# Altium schematic sheet Power_Distribution.SchDoc
size A4; SheetNumber: 3; SheetTotal: 5
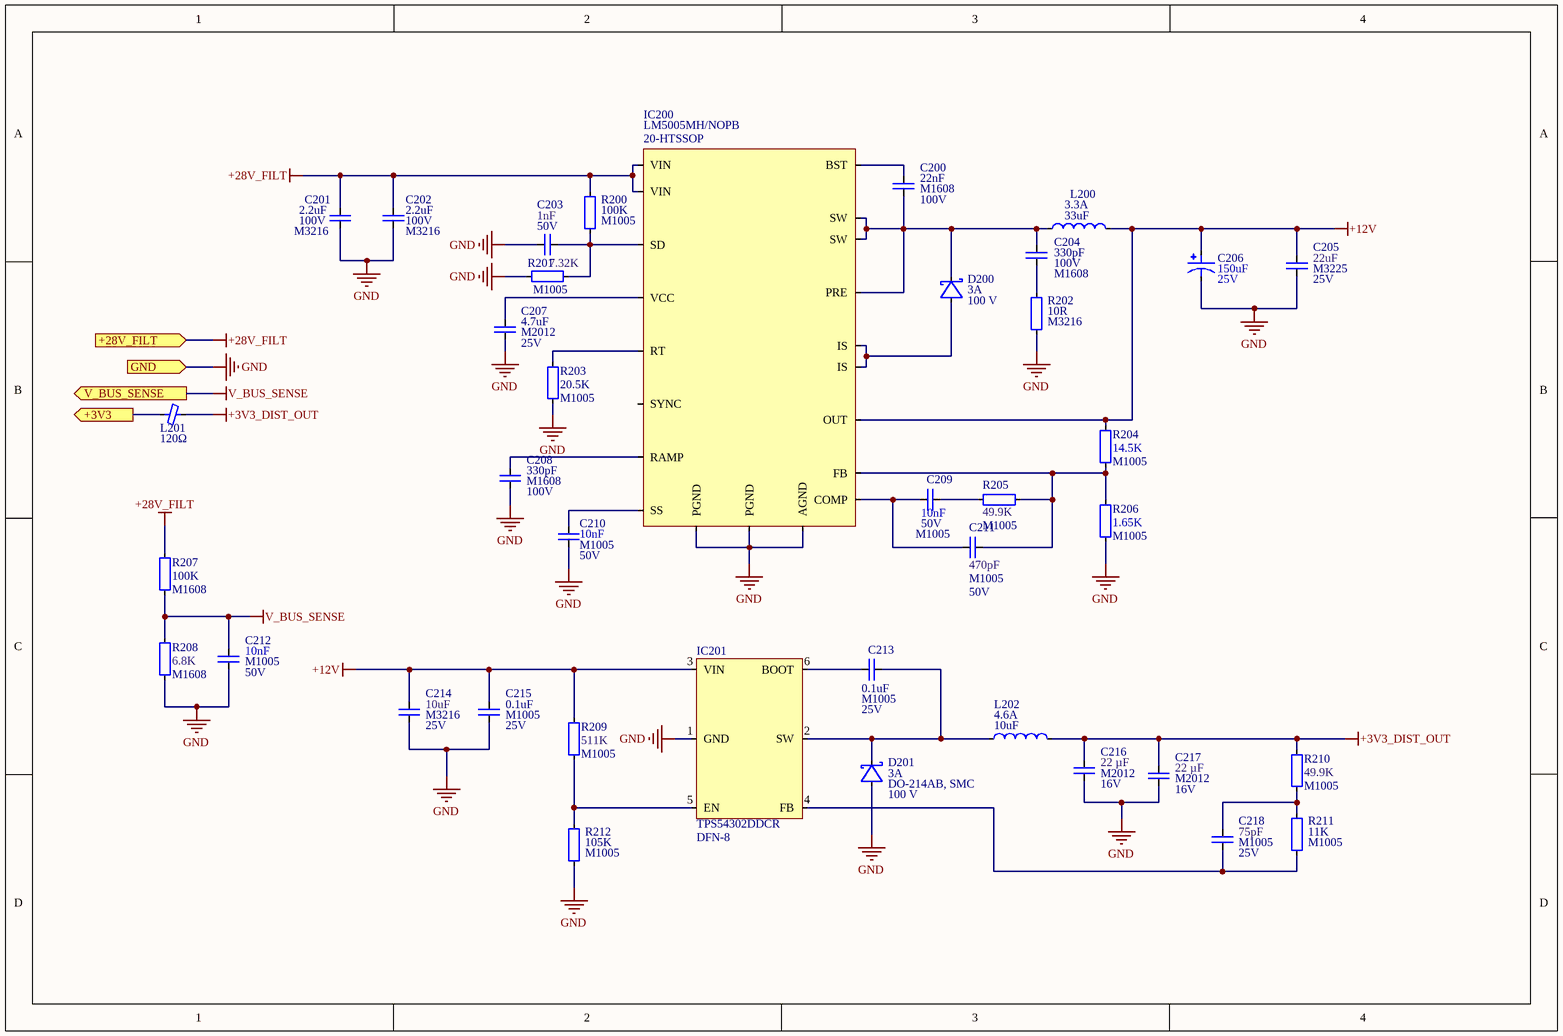
[diagram p0: Power_Distribution.SchDoc]

## Parts
C200  value 22nF  Package: M1608  Rated Voltage: 100V  [Capacitor_Seramic_M1608_I0603]  (hidden comment: Capacitor_Seramic)
C201  value 2.2uF  Package: M3216  Rated Voltage: 100V  [Capacitor_Seramic_M2012_I0805]  (hidden comment: Capacitor_Seramic)
C202  value 2.2uF  Package: M3216  Rated Voltage: 100V  [Capacitor_Seramic_M2012_I0805]  (hidden comment: Capacitor_Seramic)
C203  value 1nF  Rated Voltage: 50V  [Capacitor_Seramic_M1005_I0402]  (hidden comment: Capacitor_Seramic)
C204  value 330pF  Package: M1608  Rated Voltage: 100V  [Capacitor_Seramic_M1608_I0603]  (hidden comment: Capacitor_Seramic)
C205  value 22uF  Package: M3225  Rated Voltage: 25V  [Capacitor_Seramic_M3225_I1210]  (hidden comment: Capacitor_Seramic)
C206  value 150uF  Rated Voltage: 25V  [CAP_ZK_D8_PAN]  (hidden comment: Capacitor_Aluminum)
C207  value 4.7uF  Package: M2012  Rated Voltage: 25V  [Capacitor_Seramic_M2012_I0805]  (hidden comment: Capacitor_Seramic)
C208  value 330pF  Package: M1608  Rated Voltage: 100V  [Capacitor_Seramic_M1608_I0603]  (hidden comment: Capacitor_Seramic)
C209  value 10nF  Package: M1005  Rated Voltage: 50V  [Capacitor_Seramic_M1005_I0402]  (hidden comment: Capacitor_Seramic)
C210  value 10nF  Package: M1005  Rated Voltage: 50V  [Capacitor_Seramic_M1005_I0402]  (hidden comment: Capacitor_Seramic)
C211  value 470pF  Package: M1005  Rated Voltage: 50V  [Capacitor_Seramic_M1005_I0402]  (hidden comment: Capacitor_Seramic)
C212  value 10nF  Package: M1005  Rated Voltage: 50V  [Capacitor_Seramic_M1005_I0402]  (hidden comment: Capacitor_Seramic)
C213  value 0.1uF  Package: M1005  Rated Voltage: 25V  [Capacitor_Seramic_M1005_I0402]  (hidden comment: Capacitor_Seramic)
C214  value 10uF  Package: M3216  Rated Voltage: 25V  [Capacitor_Seramic_M3216_I1206]  (hidden comment: Capacitor_Seramic)
C215  value 0.1uF  Package: M1005  Rated Voltage: 25V  [Capacitor_Seramic_M1005_I0402]  (hidden comment: Capacitor_Seramic)
C216  value 22 µF  Package: M2012  Rated Voltage: 16V  [Capacitor_Seramic_M2012_I0805]  (hidden comment: Capacitor_Seramic)
C217  value 22 µF  Package: M2012  Rated Voltage: 16V  [Capacitor_Seramic_M2012_I0805]  (hidden comment: Capacitor_Seramic)
C218  value 75pF  Package: M1005  Rated Voltage: 25V  [Capacitor_Seramic_M1005_I0402]  (hidden comment: Capacitor_Seramic)
D200  Current: 3A  Voltage: 100 V  [SMC_DIO]  (hidden comment: Diode_Schottky)
D201  Current: 3A  Package: DO-214AB, SMC  Voltage: 100 V  [SMC_DIO]  (hidden comment: Diode_Schottky)
IC200  Manufacturer Part Number: LM5005MH/NOPB  Package: 20-HTSSOP  [TI, LM5005, 20-HTSSOP]  (hidden comment: TI, LM5005, 20-HTSSOP)
IC201  Manufacturer Part Number: TPS54302DDCR  Package: DFN-8  [SOT-23-6Pin]  (hidden comment: TI, TPS54302)
L200  value 33uF  Saturation Current: 3.3A  [Bourns - SRR1280]  (hidden comment: Inductor)
L201  value 120Ω  [Ferrite_Bead_Smd_M1608_I0603]  (hidden comment: Ferrite Bead)
L202  value 10uF  Saturation Current: 4.6A  [Bourns - SRN6045TA]  (hidden comment: Inductor)
R200  value 100K  Package: M1005  [Resistor_SMD_M1005_I0402]  (hidden comment: Resistor)
R201  value 7.32K  Package: M1005  [Resistor_SMD_M1005_I0402]  (hidden comment: Resistor)
R202  value 10R  Package: M3216  [Resistor_SMD_M3216_I1206]  (hidden comment: Resistor)
R203  value 20.5K  Package: M1005  [Resistor_SMD_M1005_I0402]  (hidden comment: Resistor)
R204  value 14.5K  Package: M1005  [Resistor_SMD_M1005_I0402]  (hidden comment: Resistor)
R205  value 49.9K  Package: M1005  [Resistor_SMD_M1005_I0402]  (hidden comment: Resistor)
R206  value 1.65K  Package: M1005  [Resistor_SMD_M1005_I0402]  (hidden comment: Resistor)
R207  value 100K  Package: M1608  [Resistor_SMD_M1608_I0603]  (hidden comment: Resistor)
R208  value 6.8K  Package: M1608  [Resistor_SMD_M1608_I0603]  (hidden comment: Resistor)
R209  value 511K  Package: M1005  [Resistor_SMD_M1005_I0402]  (hidden comment: Resistor)
R210  value 49.9K  Package: M1005  [Resistor_SMD_M1005_I0402]  (hidden comment: Resistor)
R211  value 11K  Package: M1005  [Resistor_SMD_M1005_I0402]  (hidden comment: Resistor)
R212  value 105K  Package: M1005  [Resistor_SMD_M1005_I0402]  (hidden comment: Resistor)

## Ports
+3V3 (out), +28V_FILT (in), GND (in), V_BUS_SENSE (out)

## Nets
+3V3_DIST_OUT: C216.1 C217.1 L201.2 L202.2 R210.1
+12V: C205.1 C206.1 C214.1 C215.1 IC200.12-OUT(OUT) IC201.3(VIN) L200.2 R204.2 R209.1
+28V_FILT: C201.1 C202.1 IC200.3-VIN(VIN) IC200.4-VIN(VIN) R200.1 R207.2 ; port +28V_FILT
GND: C201.2 C202.2 C203.2 C205.2 C206.2 C207.2 C208.2 C210.2 C212.2 C214.2 C215.2 C216.2 C217.2 D201.A(Anode) IC200.10-AGND(AGND) IC200.13-PGND(PGND) IC200.14-PGND(PGND) IC201.1(GND) R201.1 R202.2 R203.2 R206.1 R208.2 R212.2 ; port GND
V_BUS_SENSE: C212.1 R207.1 R208.1 ; port V_BUS_SENSE
+3V3: L201.1 ; port +3V3
NetC200_1: C200.1 IC200.20-BST(BST)
NetC200_2: C200.2 C204.1 D200.K(Katode) IC200.17-SW(SW) IC200.18-SW(SW) IC200.19-PRE(PRE) L200.1
NetC203_1: C203.1 IC200.2-SD(SD) R200.2 R201.2
NetC204_2: C204.2 R202.1
NetC207_1: C207.1 IC200.1-VCC(VCC)
NetC208_1: C208.1 IC200.9-RAMP(RAMP)
NetC209_1: C209.1 C211.2 IC200.6-COMP(COMP)
NetC209_2: C209.2 R205.2
NetC210_1: C210.1 IC200.11-SS(SS)
NetC211_1: C211.1 IC200.7-FB(FB) R204.1 R205.1 R206.2
NetC213_1: C213.1 IC201.6(BOOT)
NetC213_2: C213.2 D201.K(Katode) IC201.2(SW) L202.1
NetC218_1: C218.1 R210.2 R211.1
NetC218_2: C218.2 IC201.4(FB) R211.2
NetD200_A: D200.A(Anode) IC200.15-IS(IS) IC200.16-IS(IS)
NetIC200_8-RT: IC200.8-RT(RT) R203.1
NetIC201_5: IC201.5(EN) R209.2 R212.1

Not connected (* = marked no-connect by the designer): IC200 5-SYNC(SYNC)

## Library data of the parts
C200 = Capacitor_Seramic: Cap, Cer, 22nF, 100V, M1608; Manufacturer Part Number: CC0603KRX7R0BB223; Manufacturer: YAGEO; Tolerance: ±10%; Temperature Coefficient: X7R; ComponentLink1Description: Datasheet; ComponentLink1URL: *; ComponentLink2Description: Supplier Link; ComponentLink2URL: https://www.digikey.com/en/products/detail/yageo/CC0603KRX7R0BB223/5195200; Supplier Part Number: 311-1792-1-ND; Supplier Link: https://www.digikey.com/en/products/detail/yageo/CC0603KRX7R0BB223/5195200; Supplier Currency: $; Supplier: Digikey; Quantity, Min: 1; Quantity, Max: 1,000; Price, Min: $0.11000; Price, Max: $0.02315; Operating Temperature, Min: -55℃; Operating Temperature, Max: +125℃; Component Type: Ceramic; Component Category: Capacitor
C201 C202 = Capacitor_Seramic: Cap, Cer, 2.2uF, 100V, M3216; Manufacturer Part Number: AC1206KKX7R0BB225; Manufacturer: YAGEO; Tolerance: ±10%; Temperature Coefficient: X7R; ComponentLink1Description: Datasheet; ComponentLink1URL: *; ComponentLink2Description: Supplier Link; ComponentLink2URL: https://www.digikey.com/en/products/detail/yageo/AC1206KKX7R0BB225/16797723; Supplier Part Number: 13-AC1206KKX7R0BB225CT-ND; Supplier Link: https://www.digikey.com/en/products/detail/yageo/AC1206KKX7R0BB225/16797723; Supplier Currency: $; Supplier: Digikey; Quantity, Min: 1; Quantity, Max: 1,000; Price, Min: $1.08000; Price, Max: $0.39533; Operating Temperature, Min: -55℃; Operating Temperature, Max: +125℃; Component Type: Ceramic; Component Category: Capacitor
C203 = Capacitor_Seramic: Cap, Cer, 1nF, 50V, M1005; Manufacturer Part Number: CC0402KRX7R9BB102; Manufacturer: Yageo; Tolerance: ±10%; Temperature Coefficient: X7R; ComponentLink1Description: Datasheet; ComponentLink1URL: C:\Users\User\OneDrive - Karadeniz Teknik University\Masaüstü\pcb\Altium-Designer-ile-Elektronik-Devre-Karti-Tasarimi_2024-main\Datasheets\Capacitor\Walsin - Multilayer Ceramic Capacitors.pdf; ComponentLink2Description: Supplier Link; ComponentLink2URL: https://www.digikey.com/en/products/detail/yageo/CC1206MKX7RDBB102/5884663; Supplier Part Number: 311-1036-1-ND; Supplier Link: https://www.digikey.com/en/products/detail/yageo/CC0402KRX7R9BB102/302770; Supplier Currency: $; Supplier: Digikey; Quantity, Min: 1; Quantity, Max: 50; Price, Min: $0.08000; Price, Max: $0.08000; Operating Temperature, Min: -55℃; Operating Temperature, Max: +125℃; Component Type: Ceramic; Component Category: Capacitor; Package: M1005
C204 C208 = Capacitor_Seramic: Cap, Cer, 330pF, 100V, M1608; Manufacturer Part Number: CC0603JRNPO0BN331; Manufacturer: YAGEO; Tolerance: ±5%; Temperature Coefficient: X7R; ComponentLink1Description: Datasheet; ComponentLink1URL: *; ComponentLink2Description: Supplier Link; ComponentLink2URL: https://www.digikey.com/en/products/detail/yageo/CC0603JRNPO0BN331/5195168; Supplier Part Number: 311-1759-1-ND; Supplier Link: https://www.digikey.com/en/products/detail/yageo/CC0603JRNPO0BN331/5195168; Supplier Currency: $; Supplier: Digikey; Quantity, Min: 1; Quantity, Max: 1,000; Price, Min: $0.11000; Price, Max: $0.02444; Operating Temperature, Min: -55℃; Operating Temperature, Max: +125℃; Component Type: Ceramic; Component Category: Capacitor
C205 = Capacitor_Seramic: Cap, Cer, 22uF, 25V, M3225; Manufacturer Part Number: GRM32ER71E226KE15L; Manufacturer: Murata; Tolerance: ±10%; Temperature Coefficient: X7R; ComponentLink1Description: Datasheet; ComponentLink1URL: C:\Users\User\OneDrive - Karadeniz Teknik University\Masaüstü\pcb\Altium-Designer-ile-Elektronik-Devre-Karti-Tasarimi_2024-main\Datasheets\Capacitor\Murata - Multilayer Ceramic Capacitors.pdf; ComponentLink2Description: Supplier Link; ComponentLink2URL: https://www.digikey.com/en/products/detail/murata-electronics/GRM32ER71E226KE15L/2039040; Supplier Part Number: 490-5313-1-ND; Supplier Link: https://www.digikey.com/en/products/detail/murata-electronics/GRM32ER71E226KE15L/2039040; Supplier Currency: $; Supplier: Digikey; Quantity, Min: 1; Quantity, Max: 500; Price, Min: $0.73000; Price, Max: $0.25908; Operating Temperature, Min: -55℃; Operating Temperature, Max: +85℃; Component Type: Ceramic; Component Category: Capacitor
C206 = Capacitor_Aluminum: Cap, Aluminum; Manufacturer: Panasonic; Manufacturer Part Number: EEH-ZK1E151XP; Tolerance: ±20%; Component Category: Capacitors; ComponentLink1Description: Supplier Link; ComponentLink1URL: https://www.digikey.com/en/products/detail/panasonic-electronic-components/EEH-ZA1J220XP/3088130; Temperature Coefficient: *; Component Type: Aluminum; Operating Temperature, Max: +105°C; Operating Temperature, Min: -55°C; Price, Max: $0.43280; Price, Min: $1.00000; Quantity, Max: 100; Quantity, Min: 1; Supplier: Digikey; Supplier Currency: $; Supplier Link: https://www.digikey.com/en/products/detail/panasonic-electronic-components/EEH-ZK1E151XP/6564644; Supplier Part Number: P121396CT-ND; Package: *
C207 = Capacitor_Seramic: Cap, Cer, 4.7uF, 25V, M2012; Manufacturer Part Number: C2012X7R1E475K125AB; Manufacturer: TDK Corporation; Tolerance: ±10%; Temperature Coefficient: X7R; ComponentLink1Description: Datasheet; ComponentLink1URL: *; ComponentLink2Description: Supplier Link; ComponentLink2URL: https://www.digikey.com/en/products/detail/tdk-corporation/C2012X7R1E475K125AB/2443450; Supplier Part Number: 445-5972-1-ND; Supplier Link: https://www.digikey.com/en/products/detail/tdk-corporation/C2012X7R1E475K125AB/2443450; Supplier Currency: $; Supplier: Digikey; Quantity, Min: 1; Quantity, Max: 1,000; Price, Min: $0.08389; Price, Max: $0.31000; Operating Temperature, Min: -55℃; Operating Temperature, Max: +125℃; Component Type: Ceramic; Component Category: Capacitor
C209 C210 C212 = Capacitor_Seramic: Cap, Cer, 10nF, 50V, M1005; Manufacturer Part Number: CC0402KRX7R9BB103; Manufacturer: Yageo; Tolerance: ±10%; Temperature Coefficient: X7R; ComponentLink1Description: Datasheet; ComponentLink1URL: *; ComponentLink2Description: Supplier Link; ComponentLink2URL: https://www.digikey.com/en/products/detail/yageo/CC0402KRX7R9BB103/2103087; Supplier Part Number: 311-1349-1-ND; Supplier Link: https://www.digikey.com/en/products/detail/yageo/CC0402KRX7R9BB103/2103087; Supplier Currency: $; Supplier: Digikey; Quantity, Min: 1; Quantity, Max: 10; Price, Min: $0.08000; Price, Max: $0.00300; Operating Temperature, Min: -55℃; Operating Temperature, Max: +125℃; Component Type: Ceramic; Component Category: Capacitor
C211 = Capacitor_Seramic: Cap, Cer, 470pF, 50V, M1005; Manufacturer Part Number: CC0402JRNPO9BN471; Manufacturer: YAGEO; Tolerance: ±5%; Temperature Coefficient: X7R; ComponentLink1Description: Datasheet; ComponentLink1URL: C:\Users\User\OneDrive - Karadeniz Teknik University\Masaüstü\pcb\Altium-Designer-ile-Elektronik-Devre-Karti-Tasarimi_2024-main\Datasheets\Capacitor\Walsin - Multilayer Ceramic Capacitors.pdf; ComponentLink2Description: Supplier Link; ComponentLink2URL: https://www.digikey.com/en/products/detail/yageo/CC0402JRNPO9BN471/5195080; Supplier Part Number: 311-1671-1-ND; Supplier Link: https://www.digikey.com/en/products/detail/yageo/CC0402JRNPO9BN471/5195080; Supplier Currency: $; Supplier: Digikey; Quantity, Min: 1; Quantity, Max: 50; Price, Min: $0.01290; Price, Max: $0.10000; Operating Temperature, Min: -55℃; Operating Temperature, Max: +125℃; Component Type: Ceramic; Component Category: Capacitor
C213 C215 = Capacitor_Seramic: Cap, Cer, 0.1uF, 25V, M1005; Manufacturer Part Number: CC0402KRX7R8BB104; Manufacturer: YAGEO; Tolerance: ±10%; Temperature Coefficient: X7R; ComponentLink1Description: Datasheet; ComponentLink1URL: *; ComponentLink2Description: Supplier Link; ComponentLink2URL: https://www.digikey.com/en/products/detail/yageo/CC0402KRX7R8BB104/5698946; Supplier Part Number: 311-2077-1-ND; Supplier Link: https://www.digikey.com/en/products/detail/yageo/CC0402KRX7R8BB104/5698946; Supplier Currency: $; Supplier: Digikey; Quantity, Min: 1; Quantity, Max: 1,000; Price, Min: $0.10000; Price, Max: $0.00700; Operating Temperature, Min: -55℃; Operating Temperature, Max: +125℃; Component Type: Ceramic; Component Category: Capacitor
C214 = Capacitor_Seramic: Cap, Cer, 10uF, 25V, M3216; Manufacturer Part Number: CL31B106KAHNFNE; Manufacturer: Samsung Electro-Mechanics; Tolerance: ±10%; Temperature Coefficient: X7R; ComponentLink1Description: Datasheet; ComponentLink1URL: C:\Users\User\OneDrive - Karadeniz Teknik University\Masaüstü\pcb\Altium-Designer-ile-Elektronik-Devre-Karti-Tasarimi_2024-main\Datasheets\Capacitor\Walsin - Multilayer Ceramic Capacitors.pdf; ComponentLink2Description: Supplier Link; ComponentLink2URL: https://www.digikey.com/en/products/detail/samsung-electro-mechanics/CL31B106KAHNFNE/3888758; Supplier Part Number: 1276-3100-1-ND; Supplier Link: https://www.digikey.com/en/products/detail/samsung-electro-mechanics/CL31B106KAHNFNE/3888758; Supplier Currency: $; Supplier: Digikey; Quantity, Min: 1; Quantity, Max: 1,000; Price, Min: $0.21000; Price, Max: $0.05159; Operating Temperature, Min: -55℃; Operating Temperature, Max: +125°C; Component Type: Ceramic; Component Category: Capacitor
C216 C217 = Capacitor_Seramic: Cap, Cer, 22uF, 16V, M2012; Manufacturer Part Number: GRM21BR61C226ME44L; Manufacturer: Murata Electronics; Tolerance: 20%; Temperature Coefficient: X5R; ComponentLink1Description: Datasheet; ComponentLink1URL: C:\Users\User\OneDrive - Karadeniz Teknik University\Masaüstü\pcb\Altium-Designer-ile-Elektronik-Devre-Karti-Tasarimi_2024-main\Datasheets\Capacitor\Murata - Multilayer Ceramic Capacitors.pdf; ComponentLink2Description: Supplier Link; ComponentLink2URL: https://www.digikey.com/en/products/detail/murata-electronics/GRM21BR60J226ME39K/2546881; Supplier Part Number: 490-10747-1-ND; Supplier Link: https://www.digikey.com/en/products/detail/murata-electronics/GRM21BR61C226ME44L/4905531; Supplier Currency: $; Supplier: Digikey; Quantity, Min: 1; Quantity, Max: 1,000; Price, Min: $0.32000; Price, Max: $0.08990; Operating Temperature, Min: -55℃; Operating Temperature, Max: +85℃; Component Type: Ceramic; Component Category: Capacitor
C218 = Capacitor_Seramic: Cap, Cer, 75pF, 25V, M1005; Manufacturer Part Number: CC0402JRNPO9BN750; Manufacturer: YAGEO; Tolerance: ±5%; Temperature Coefficient: C0G, NP0; ComponentLink1Description: Datasheet; ComponentLink1URL: C:\Users\User\OneDrive - Karadeniz Teknik University\Masaüstü\pcb\Altium-Designer-ile-Elektronik-Devre-Karti-Tasarimi_2024-main\Datasheets\Capacitor\Walsin - Multilayer Ceramic Capacitors.pdf; ComponentLink2Description: Supplier Link; ComponentLink2URL: https://www.digikey.com/en/products/detail/walsin-technology-corporation/0402N220J250CT/9354779; Supplier Part Number: 311-3755-1-ND; Supplier Link: https://www.digikey.com/en/products/detail/yageo/CC0402JRNPO9BN750/5883280; Supplier Currency: $; Supplier: Digikey; Quantity, Min: 1; Quantity, Max: 2,500; Price, Min: $0.10000; Price, Max: $0.01020; Operating Temperature, Min: -55℃; Operating Temperature, Max: +125℃; Component Type: Ceramic; Component Category: Capacitor
D200 D201 = Diode_Schottky: Manufacturer Part Number: B3100-13-F; Manufacturer: Diodes Incorporated; Component Category: Diode; ComponentLink1Description: Datasheet; ComponentLink1URL: *; ComponentLink2Description: Supplier Link; Component Type: Schottky; Supplier Link: https://www.digikey.com/en/products/detail/diodes-incorporated/B3100-13-F/808529; Supplier Currency: $; Price, Max: $0.26430; Price, Min: $0.46000; Quantity, Max: 500; Quantity, Min: 1; Operating Temperature, Max: +125°C; Operating Temperature, Min: -55°C; Supplier Part Number: B3100-FDICT-ND; Supplier: Digikey
  D200: ComponentLink2URL: *; Package: DO-214AB, SMC
  D201: ComponentLink2URL: https://www.digikey.com/en/products/detail/diodes-incorporated/B3100-13-F/808529
IC200 = TI, LM5005, 20-HTSSOP: IC, Power, DC-DC, Texas Instruments, LM5005, HTSSOP, 20 Pin; ComponentLink1Description: Datasheet; ComponentLink1URL: C:\Users\User\OneDrive - Karadeniz Teknik University\Masaüstü\pcb\kütüphane\Datasheet\lm5005.pdf; ComponentLink2Description: Supplier Link; ComponentLink2URL: https://www.digikey.com/en/products/detail/texas-instruments/LM5005MH-NOPB/953430; Supplier Part Number: LM5005MH/NOPB-ND; Supplier Link: https://www.digikey.com/en/products/detail/texas-instruments/LM5005MH-NOPB/953430; Supplier Currency: $; Supplier: Digikey; Quantity, Min: 1; Quantity, Max: 2,555; Price, Min: $4.97000; Price, Max: $2.75496; Operating Temperature, Min: -40℃; Operating Temperature, Max: +85℃; Manufacturer: Texas Instruments; Component Type: IC; Component Category: Power
IC201 = TI, TPS54302: IC, Power, DC-DC, Texas Instruments, TPS54302; ComponentLink1Description: Datasheet; ComponentLink1URL: C:\Users\User\OneDrive - Karadeniz Teknik University\Masaüstü\pcb\kütüphane\Datasheet\tps54302.pdf; ComponentLink2Description: Supplier Link; ComponentLink2URL: https://www.digikey.com/en/products/detail/diodes-incorporated/AP3441SHE-7B/9765636; Supplier Part Number: 296-46237-1-ND; Supplier Link: https://www.digikey.com/en/products/detail/texas-instruments/TPS54302DDCR/6572466; Supplier Currency: $; Supplier: Digikey; Quantity, Min: 1; Quantity, Max: 1,000; Price, Min: $1.29000; Price, Max: $0.65633; Operating Temperature, Min: -40℃; Operating Temperature, Max: +85℃; Manufacturer: Texas Instruments; Component Type: IC; Component Category: Power
L200 = Inductor: Manufacturer Part Number: SRR1280-330M; Manufacturer: Bourns Inc.; ComponentLink1Description: Datasheet; ComponentLink1URL: *; ComponentLink2Description: Supplier Link; ComponentLink2URL: https://www.digikey.com/en/products/detail/bourns-inc/SRR1280-330M/1969998; Component Category: Inductor; Component Type: Power Inductor; Supplier Link: https://www.digikey.com/en/products/detail/bourns-inc/SRR1280-330M/1969998; Supplier Currency: $; Price, Max: $0.75490; Price, Min: $1.12000; Quantity, Max: 100; Quantity, Min: 1; Operating Temperature, Max: +125°C; Operating Temperature, Min: -40°C; Supplier Part Number: SRR1280-330MCT-ND; Supplier: Digikey; Package: *
L201 = Ferrite Bead: Manufacturer Part Number: BLM18PG121SN1D; Manufacturer: Murata Electronics; Component Category: Inductor; ComponentLink1Description: Datasheet; ComponentLink1URL: *; ComponentLink2Description: Supplier Link; ComponentLink2URL: https://www.digikey.com/en/products/detail/murata-electronics/BLM18PG121SN1D/584248; Supplier: Digikey; Supplier Part Number: 490-1037-1-ND; Operating Temperature, Min: -55℃; Operating Temperature, Max: +125℃; Quantity, Min: 1; Quantity, Max: 1,000; Price, Min: $0.10000; Price, Max: $0.02791; Supplier Currency: $; Supplier Link: https://www.digikey.com/en/products/detail/murata-electronics/BLM18PG121SN1D/584248; Component Type: Ferrite Bead; Package: M1608
L202 = Inductor: Manufacturer Part Number: SRN6045TA-100MCT-ND; Manufacturer: Bourns Inc.; ComponentLink1Description: Datasheet; ComponentLink1URL: *; ComponentLink2Description: Supplier Link; ComponentLink2URL: *; Component Category: Inductor; Component Type: Power Inductor; Supplier Link: https://www.digikey.com/en/products/detail/bourns-inc/SRN6045TA-100M/6155107; Supplier Currency: $; Price, Max: $0.30170; Price, Min: $0.45000; Quantity, Max: 100; Quantity, Min: 1; Operating Temperature, Max: +125°C; Operating Temperature, Min: -55°C; Supplier Part Number: SRN6045TA-100MCT-ND; Supplier: Digikey; Package: *
R200 = Resistor: Res, 100K, 1%, M1005; Manufacturer: Yageo; Manufacturer Part Number: RC0402FR-07100KP; Supplier: Digikey; Supplier Part Number: 13-RC0402FR-07100KPCT-ND; Operating Temperature, Min: -55℃; Operating Temperature, Max: +155℃; Quantity, Min: 1; Quantity, Max: 10,000; Price, Min: $0.12000; Price, Max: $0.00306; Supplier Currency: $; Supplier Link: https://www.digikey.com/en/products/detail/yageo/RC0402FR-07100KP/12698883; Tolerance: 1%; Component Type: Fixed Value; Component Category: Resistor; ComponentLink1Description: Datasheet; ComponentLink1URL: C:\Users\Public\Documents\Altium\env\Datasheets\Resistor\Yageo - RC_L Series.pdf; ComponentLink2Description: Supplier Link; ComponentLink2URL: https://www.digikey.com/en/products/detail/yageo/RC0402FR-07100KP/12698883
R201 = Resistor: Res, 7.32K, 1%, M1005; Manufacturer: YAGEO; Manufacturer Part Number: RC0402FR-077K32L; Supplier: Digikey; Supplier Part Number: YAG3236CT-ND; Operating Temperature, Min: -55℃; Operating Temperature, Max: +155℃; Quantity, Min: 1; Quantity, Max: 25; Price, Min: $0.00320; Price, Max: $0.10000; Supplier Currency: $; Supplier Link: https://www.digikey.com/en/products/detail/yageo/RC0402FR-077K32L/5281096; Tolerance: 1%; Component Type: Fixed Value; Component Category: Resistor; ComponentLink1Description: Datasheet; ComponentLink1URL: C:\Users\Public\Documents\Altium\env\Datasheets\Resistor\Yageo - RC_L Series.pdf; ComponentLink2Description: Supplier Link; ComponentLink2URL: https://www.digikey.com/en/products/detail/yageo/RC0402FR-077K32L/5281096
R202 = Resistor: Manufacturer: Yageo; Manufacturer Part Number: RC1206FR-0710RL; Supplier: Digikey; Supplier Part Number: 311-10.0FRCT-ND; Operating Temperature, Min: -55℃; Operating Temperature, Max: +155℃; Quantity, Min: 1; Quantity, Max: 10; Price, Min: $0.02200; Price, Max: $0.10000; Supplier Currency: $; Supplier Link: https://www.digikey.com/en/products/detail/yageo/RC1206FR-0710RL/728482; Tolerance: *; Component Type: Fixed Value; Component Category: Resistor; ComponentLink1Description: Datasheet; ComponentLink1URL: C:\Users\Public\Documents\Altium\env\Datasheets\Resistor\Yageo - RC_L Series.pdf; ComponentLink2Description: Supplier Link; ComponentLink2URL: https://www.digikey.com/en/products/detail/yageo/RC1206FR-0710RL/728482
R203 = Resistor: Res, 20.5K, 1%, M1005; Manufacturer: YAGEO; Manufacturer Part Number: RC0402FR-0720K5L; Supplier: Digikey; Supplier Part Number: YAG3052CT-ND; Operating Temperature, Min: -55℃; Operating Temperature, Max: +155℃; Quantity, Min: 1; Quantity, Max: 50; Price, Min: $0.10000; Price, Max: $0.00320; Supplier Currency: $; Supplier Link: https://www.digikey.com/en/products/detail/yageo/RC0402FR-0720K5L/5280912; Tolerance: 1%; Component Type: Fixed Value; Component Category: Resistor; ComponentLink1Description: Datasheet; ComponentLink1URL: C:\Users\Public\Documents\Altium\env\Datasheets\Resistor\Yageo - RC_L Series.pdf; ComponentLink2Description: Supplier Link; ComponentLink2URL: https://www.digikey.com/en/products/detail/yageo/RC0402FR-0720K5L/5280912
R204 = Resistor: Res, 1.5K, 1%, M1005; Manufacturer: Yageo; Manufacturer Part Number: RC0402FR-071K5L; Supplier: Digikey; Supplier Part Number: 311-1.50KLRCT-ND; Operating Temperature, Min: -55℃; Operating Temperature, Max: +155℃; Quantity, Min: 1; Quantity, Max: 250,000; Price, Min: $0.10000; Price, Max: $0.00181; Supplier Currency: $; Supplier Link: https://www.digikey.com/en/products/detail/yageo/RC0402FR-071K5L/726519; Tolerance: 1%; Component Type: Fixed Value; Component Category: Resistor; ComponentLink1Description: Datasheet; ComponentLink1URL: C:\Users\Public\Documents\Altium\env\Datasheets\Resistor\Yageo - RC_L Series.pdf; ComponentLink2Description: Supplier Link; ComponentLink2URL: https://www.digikey.com/en/products/detail/yageo/RC0402FR-071K5L/726519
R205 R210 = Resistor: Res, 49.9K, 1%, M1005; Manufacturer: YAGEO; Manufacturer Part Number: RC0402FR-0749K9L; Supplier: Digikey; Supplier Part Number: 311-49.9KLRCT-ND; Operating Temperature, Min: -55℃; Operating Temperature, Max: +155℃; Quantity, Min: 1; Quantity, Max: 250; Price, Min: $0.10000; Price, Max: $0.00328; Supplier Currency: $; Supplier Link: https://www.digikey.com/en/products/detail/yageo/RC0402FR-0749K9L/726620; Tolerance: 1%; Component Type: Fixed Value; Component Category: Resistor; ComponentLink1Description: Datasheet; ComponentLink1URL: C:\Users\Public\Documents\Altium\env\Datasheets\Resistor\Yageo - RC_L Series.pdf; ComponentLink2Description: Supplier Link; ComponentLink2URL: https://www.digikey.com/en/products/detail/yageo/RC0402FR-0749K9L/726620
R206 = Resistor: Res, 1.65K, 1%, M1005; Manufacturer: YAGEO; Manufacturer Part Number: RC0402FR-071K65L; Supplier: Digikey; Supplier Part Number: YAG3043CT-ND; Operating Temperature, Min: -55℃; Operating Temperature, Max: +155℃; Quantity, Min: 1; Quantity, Max: 50; Price, Min: $0.10000; Price, Max: $0.00320; Supplier Currency: $; Supplier Link: https://www.digikey.com/en/products/detail/yageo/RC0402FR-071K65L/5280903; Tolerance: 1%; Component Type: Fixed Value; Component Category: Resistor; ComponentLink1Description: Datasheet; ComponentLink1URL: C:\Users\Public\Documents\Altium\env\Datasheets\Resistor\Yageo - RC_L Series.pdf; ComponentLink2Description: Supplier Link; ComponentLink2URL: https://www.digikey.com/en/products/detail/yageo/RC0402FR-071K65L/5280903
R207 = Resistor: Res, 100K, 1%, M1608; Manufacturer: YAGEO; Manufacturer Part Number: RC0603FR-07100KL; Supplier: Digikey; Supplier Part Number: 311-100KHRCT-ND; Operating Temperature, Min: -55℃; Operating Temperature, Max: +155℃; Quantity, Min: 1; Quantity, Max: 25; Price, Min: $0.10000; Price, Max: $0.00560; Supplier Currency: $; Supplier Link: https://www.digikey.com/en/products/detail/yageo/RC0603FR-07100KL/726889; Tolerance: 1%; Component Type: Fixed Value; Component Category: Resistor; ComponentLink1Description: Datasheet; ComponentLink1URL: *; ComponentLink2Description: Supplier Link; ComponentLink2URL: https://www.digikey.com/en/products/detail/yageo/RC0603FR-07100KL/726889
R208 = Resistor: Res, 6.8K, 1%, M1608; Manufacturer: YAGEO; Manufacturer Part Number: RC0603FR-076K8L; Supplier: Digikey; Supplier Part Number: 311-6.80KHRCT-ND; Operating Temperature, Min: -55℃; Operating Temperature, Max: +155℃; Quantity, Min: 1; Quantity, Max: 100; Price, Min: $0.00570; Price, Max: $0.10000; Supplier Currency: $; Supplier Link: https://www.digikey.com/en/products/detail/yageo/RC0603FR-076K8L/727323; Tolerance: 1%; Component Type: Fixed Value; Component Category: Resistor; ComponentLink1Description: Datasheet; ComponentLink1URL: *; ComponentLink2Description: Supplier Link; ComponentLink2URL: https://www.digikey.com/en/products/detail/yageo/RC0603FR-076K8L/727323
R209 = Resistor: Res, 511K, 1%, M1005; Manufacturer: YAGEO; Manufacturer Part Number: RC0402FR-07511KL; Supplier: Digikey; Supplier Part Number: YAG3176CT-ND; Operating Temperature, Min: -55℃; Operating Temperature, Max: +155℃; Quantity, Min: 1; Quantity, Max: 25; Price, Min: $0.10000; Price, Max: $0.00320; Supplier Currency: $; Supplier Link: https://www.digikey.com/en/products/detail/yageo/RC0402FR-07511KL/5281036; Tolerance: 1%; Component Type: Fixed Value; Component Category: Resistor; ComponentLink1Description: Datasheet; ComponentLink1URL: C:\Users\Public\Documents\Altium\env\Datasheets\Resistor\Yageo - RC_L Series.pdf; ComponentLink2Description: Supplier Link; ComponentLink2URL: https://www.digikey.com/en/products/detail/yageo/RC0402FR-07511KL/5281036
R211 = Resistor: Res, 11K, 1%, M1005; Manufacturer: YAGEO; Manufacturer Part Number: RC0402FR-0711KL; Supplier: Digikey; Supplier Part Number: 311-11.0KLRCT-ND; Operating Temperature, Min: -55℃; Operating Temperature, Max: +155℃; Quantity, Min: 1; Quantity, Max: 100; Price, Min: $0.10000; Price, Max: $0.00330; Supplier Currency: $; Supplier Link: https://www.digikey.com/en/products/detail/yageo/RC0402FR-0711KL/726528; Tolerance: 1%; Component Type: Fixed Value; Component Category: Resistor; ComponentLink1Description: Datasheet; ComponentLink1URL: C:\Users\Public\Documents\Altium\env\Datasheets\Resistor\Yageo - RC_L Series.pdf; ComponentLink2Description: Supplier Link; ComponentLink2URL: https://www.digikey.com/en/products/detail/yageo/RC0402FR-0711KL/726528
R212 = Resistor: Res, 105K, 1%, M1005; Manufacturer: YAGEO; Manufacturer Part Number: RC0402FR-07105KL; Supplier: Digikey; Supplier Part Number: YAG2946CT-ND; Operating Temperature, Min: -55℃; Operating Temperature, Max: +155℃; Quantity, Min: 1; Quantity, Max: 25; Price, Min: $0.10000; Price, Max: $0.00320; Supplier Currency: $; Supplier Link: https://www.digikey.com/en/products/detail/yageo/RC0402FR-07105KL/5280806; Tolerance: 1%; Component Type: Fixed Value; Component Category: Resistor; ComponentLink1Description: Datasheet; ComponentLink1URL: C:\Users\Public\Documents\Altium\env\Datasheets\Resistor\Yageo - RC_L Series.pdf; ComponentLink2Description: Supplier Link; ComponentLink2URL: https://www.digikey.com/en/products/detail/yageo/RC0402FR-07105KL/5280806